# EAGLE design md_and_to_arduino_mega (EAGLE 9.5.2)
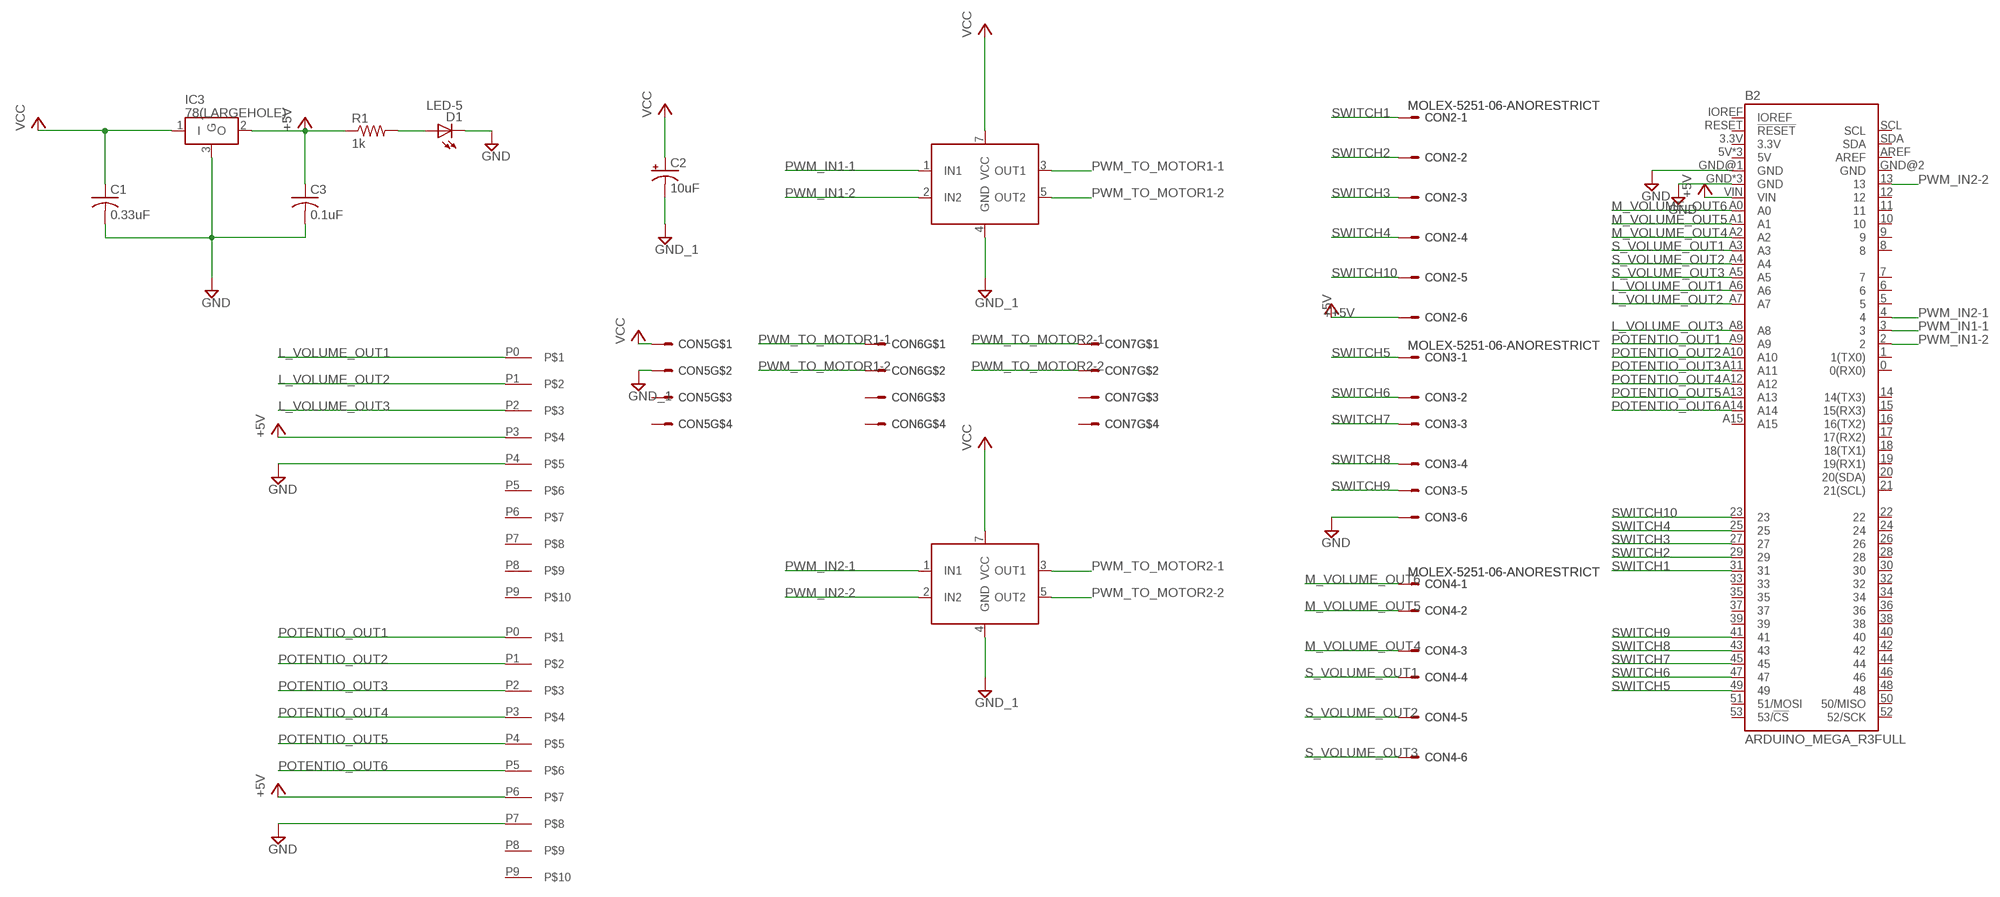
[diagram p0: schematic, sheet 1]

## Parts
B2  ARDUINO_MEGA_R3FULL  [ARDUINO_MEGA_NO_SILK]
C1  0.33uF  C-2012  [2012-C]
C2  10uF  CC-5-10.5  [E5-10,5]
C3  0.1uF  C-2012  [2012-C]
CON2  MOLEX-5251-06-ANORESTRICT  [5251-06-ANORESTRICT]
CON3  MOLEX-5251-06-ANORESTRICT  [5251-06-ANORESTRICT]
CON4  MOLEX-5251-06-ANORESTRICT  [5251-06-ANORESTRICT]
CON5  D-3200-2-VER2D3200S-2-TAB-VERTICAL-VER2  [D3200S-2-TAB-VERTICAL-VER2]
CON6  D-3200-2-VER2D3200S-2-TAB-VERTICAL-VER2  [D3200S-2-TAB-VERTICAL-VER2]
CON7  D-3200-2-VER2D3200S-2-TAB-VERTICAL-VER2  [D3200S-2-TAB-VERTICAL-VER2]
D1  LED-5  [LED5]
IC1  TA8428K  [TA8428K]
IC2  TA8428K  [TA8428K]
IC3  78(LARGEHOLE)  [7805-LARGEHOLE]
KYABE1  PINSOCKET_1X10  [PINSOCKET_1X10]
KYABE2  PINSOCKET_1X10  [PINSOCKET_1X10]
R1  1k  R-2012  [2012-R]

## Nets
+5V: B2.VIN C3.1 CON2.6 IC3.2(O) KYABE1.P6 KYABE2.P3 R1.1
GND: B2.GND B2.GND@1(GND) B2.GND@3(GND) B2.GND@4(GND) C1.2 C3.2 CON3.6 D1.K IC3.3(G) KYABE1.P7 KYABE2.P4
GND_1: C2.- CON5.2 IC1.4(GND) IC2.4(GND)
L_VOLUME_OUT1: B2.A6 KYABE2.P0
L_VOLUME_OUT2: B2.A7 KYABE2.P1
L_VOLUME_OUT3: B2.A8 KYABE2.P2
M_VOLUME_OUT4: B2.A2 CON4.3
M_VOLUME_OUT5: B2.A1 CON4.2
M_VOLUME_OUT6: B2.A0 CON4.1
N$1: D1.A R1.2
POTENTIO_OUT1: B2.A9 KYABE1.P0
POTENTIO_OUT2: B2.A10 KYABE1.P1
POTENTIO_OUT3: B2.A11 KYABE1.P2
POTENTIO_OUT4: B2.A12 KYABE1.P3
POTENTIO_OUT5: B2.A13 KYABE1.P4
POTENTIO_OUT6: B2.A14 KYABE1.P5
PWM_IN1-1: B2.3 IC1.1(IN1)
PWM_IN1-2: B2.2 IC1.2(IN2)
PWM_IN2-1: B2.4 IC2.1(IN1)
PWM_IN2-2: B2.13 IC2.2(IN2)
PWM_TO_MOTOR1-1: CON6.1 IC1.3(OUT1)
PWM_TO_MOTOR1-2: CON6.2 IC1.5(OUT2)
PWM_TO_MOTOR2-1: CON7.1 IC2.3(OUT1)
PWM_TO_MOTOR2-2: CON7.2 IC2.5(OUT2)
S_VOLUME_OUT1: B2.A3 CON4.4
S_VOLUME_OUT2: B2.A4 CON4.5
S_VOLUME_OUT3: B2.A5 CON4.6
SWITCH1: B2.31 CON2.1
SWITCH2: B2.29 CON2.2
SWITCH3: B2.27 CON2.3
SWITCH4: B2.25 CON2.4
SWITCH5: B2.49 CON3.1
SWITCH6: B2.47 CON3.2
SWITCH7: B2.45 CON3.3
SWITCH8: B2.43 CON3.4
SWITCH9: B2.41 CON3.5
SWITCH10: B2.23 CON2.5
VCC: C1.1 C2.+ CON5.1 IC1.7(VCC) IC2.7(VCC) IC3.1(I)
Unconnected: B2.0(0(RX0)) B2.1(1(TX0)) B2.3.3V B2.5 B2.5V B2.5V@1(5V) B2.5V@2(5V) B2.6 B2.7 B2.8 B2.9 B2.10 B2.11 B2.12 B2.14(14(TX3)) B2.15(15(RX3)) B2.16(16(TX2)) B2.17(17(RX2)) B2.18(18(TX1)) B2.19(19(RX1)) B2.20(20(SDA)) B2.21(21(SCL)) B2.22 B2.24 B2.26 B2.28 B2.30 B2.32 B2.33 B2.34 B2.35 B2.36 B2.37 B2.38 B2.39 B2.40 B2.42 B2.44 B2.46 B2.48 B2.50(50/MISO) B2.51(51/MOSI) B2.52(52/SCK) B2.53(53/!CS) B2.A15 B2.AREF B2.GND@2(GND) B2.IOREF B2.RESET(!RESET) B2.SCL B2.SDA CON5.P$1 CON5.P$2 CON6.P$1 CON6.P$2 CON7.P$1 CON7.P$2 KYABE1.P8 KYABE1.P9 KYABE2.P5 KYABE2.P6 KYABE2.P7 KYABE2.P8 KYABE2.P9

## Library data of the parts
B2 = SparkFun-Boards:ARDUINO_MEGA_R3: Arduino Mega R3 ATmega2560 R3 compatible footprint. SparkFun Products: Arduino Mega 2560 R3 <https://www.sparkfun.com/products/11061>
C1 C3 = Passive_Robotech:C
C2 = Passive_Robotech:CC
CON2-CON4 = Connector_Robotech:MOLEX-5251-06: CONNECTOR Molex 5251 6-pin wire to board 2.54 mm (.1 inch) pitch header
CON5-CON7 = Connector_Robotech:D-3200-2-VER2
D1 = Diode_Robotech:LED
IC1 IC2 = IC_Robotech:TA8428: Toshiba Motor Driver
IC3 = IC_Robotech:78*: Three Terminal Voltage Regulator
KYABE1 KYABE2 = mylib:PINSOCKET_1X10
R1 = Passive_Robotech:R

## Board
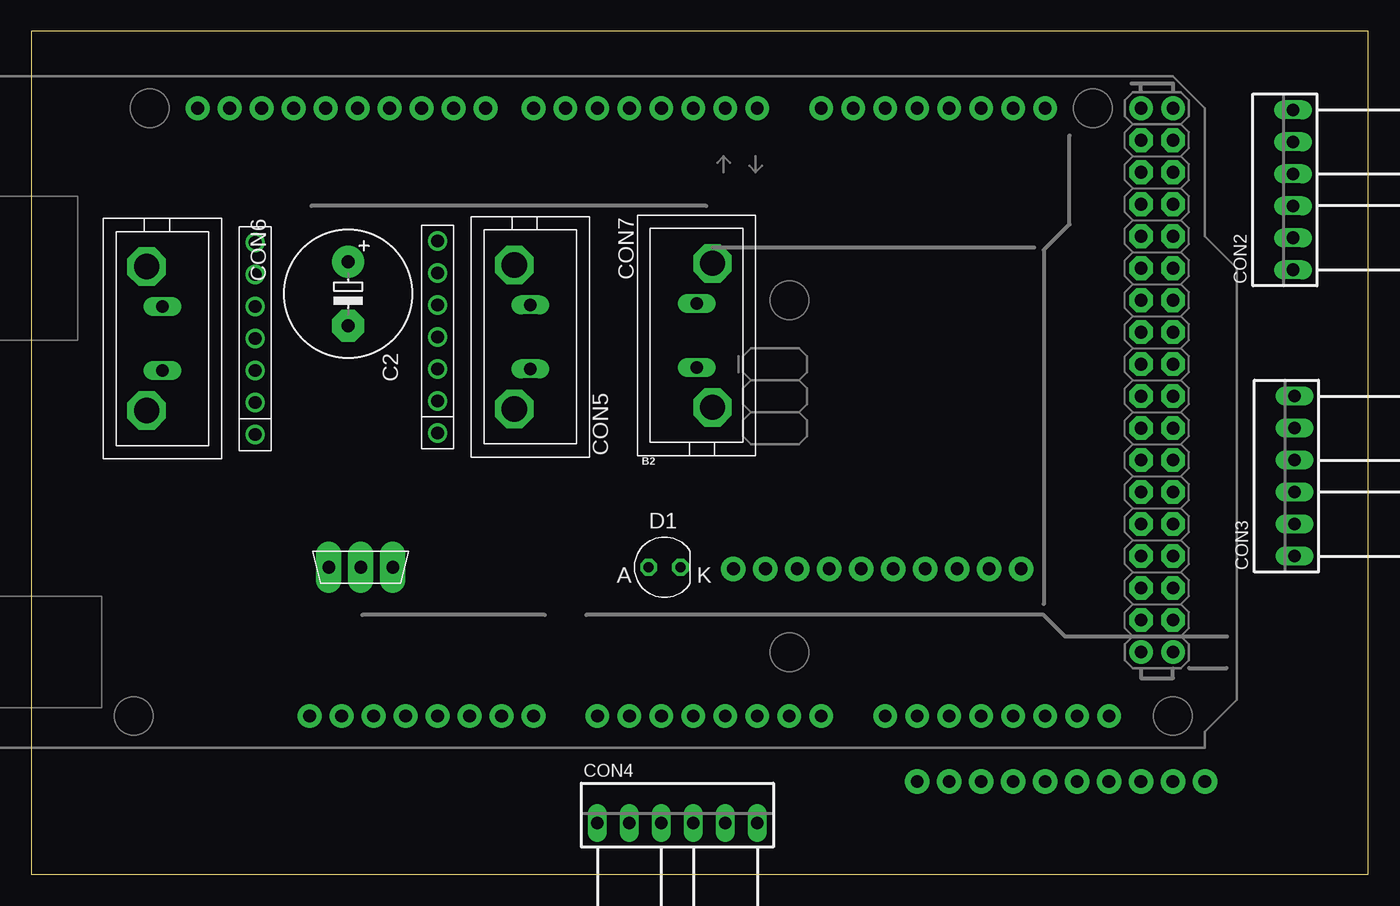
[diagram p1: board, top side]
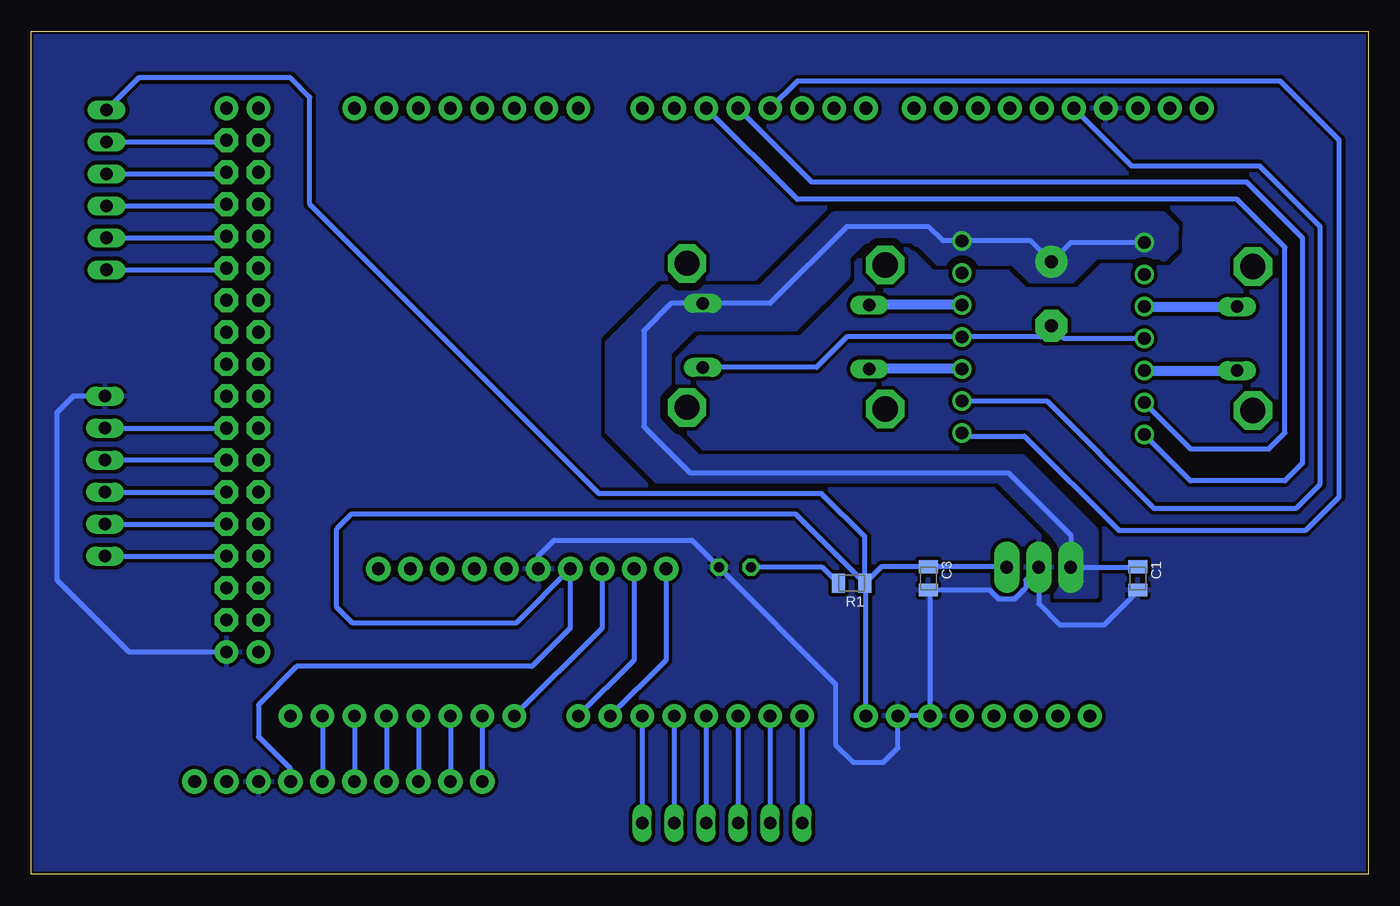
[diagram p2: board, bottom side, seen from below]

Size 106.17 x 66.93 mm. Coordinates in mm from the lower left corner, seen from the top.
Outline: 0,0 106.17,0 106.17,66.93 0,66.93 0,0
Copper layers (1*16): Top 0.0356mm / dielectric 1.5011mm / Bottom 0.0356mm
Design rules "formita": minimum track width 10mil, minimum drill 0.5994mm, track to track 0.3mm, track to pad 0.3mm, pad to pad 0.3mm, via to via 0.3mm, smd to smd 8mil, copper to edge 8mil, drill to drill 8mil, minimum pad ring 10mil, minimum via ring 8mil, stop-mask expansion 4mil, vias tented up to drill 1mm, thermal gap 10mil

### Footprints (pad centres in the part's own frame; a part is rotated, then mirrored left to right if it is on the bottom)
ARDUINO_MEGA_NO_SILK = drill 1.016 pad 1.88: 0 13.97,24.13; 1 11.43,24.13; 2 8.89,24.13; 3 6.35,24.13; 3.3V -13.97,-24.13; 4 3.81,24.13; 5 1.27,24.13; 5V -11.43,-24.13; 5V@1 44.45,24.13; 5V@2 46.99,24.13; 6 -1.27,24.13; 7 -3.81,24.13; 8 -7.62,24.13; 9 -10.16,24.13; 10 -12.7,24.13; 11 -15.24,24.13; 12 -17.78,24.13; 13 -20.32,24.13; 14 19.05,24.13; 15 21.59,24.13; 16 24.13,24.13; 17 26.67,24.13; 18 29.21,24.13; 19 31.75,24.13; 20 34.29,24.13; 21 36.83,24.13; A0 1.27,-24.13; A1 3.81,-24.13; A2 6.35,-24.13; A3 8.89,-24.13; A4 11.43,-24.13; A5 13.97,-24.13; A6 16.51,-24.13; A7 19.05,-24.13; A8 24.13,-24.13; A9 26.67,-24.13; A10 29.21,-24.13; A11 31.75,-24.13; A12 34.29,-24.13; A13 36.83,-24.13; A14 39.37,-24.13; A15 41.91,-24.13; AREF -25.4,24.13; GND -8.89,-24.13; GND@1 -6.35,-24.13; GND@2 44.45,-19.05; GND@3 46.99,-19.05; GND@4 -22.86,24.13; IOREF -19.05,-24.13; NC -21.59,-24.13; RESET -16.51,-24.13; SCL -30.48,24.13; SDA -27.94,24.13; VIN -3.81,-24.13 | drill 1.016 pad 1.88 octagon: 22 44.45,21.59; 23 46.99,21.59; 24 44.45,19.05; 25 46.99,19.05; 26 44.45,16.51; 27 46.99,16.51; 28 44.45,13.97; 29 46.99,13.97; 30 44.45,11.43; 31 46.99,11.43; 32 44.45,8.89; 33 46.99,8.89; 34 44.45,6.35; 35 46.99,6.35; 36 44.45,3.81; 37 46.99,3.81; 38 44.45,1.27; 39 46.99,1.27; 40 44.45,-1.27; 41 46.99,-1.27; 42 44.45,-3.81; 43 46.99,-3.81; 44 44.45,-6.35; 45 46.99,-6.35; 46 44.45,-8.89; 47 46.99,-8.89; 48 44.45,-11.43; 49 46.99,-11.43; 50 44.45,-13.97; 51 46.99,-13.97; 52 44.45,-16.51; 53 46.99,-16.51
2012-C = smd 1.016 x 1.524: 1 -0.921,0; 2 0.921,0
E5-10,5 = drill 1.016 pad 2.54: + -2.54,0 | drill 1.016 pad 2.54 octagon: - 2.54,0
5251-06-ANORESTRICT = drill 1 long: 1 6.35,0; 2 3.81,0; 3 1.27,0; 4 -1.27,0; 5 -3.81,0; 6 -6.35,0
D3200S-2-TAB-VERTICAL-VER2 = drill 1 long: 1 2.54,0; 2 -2.54,0 | drill 2 pad 3.048 octagon: P$1 5.715,-1.27; P$2 -5.715,-1.27
LED5 = drill 0.813 octagon: A -1.27,0; K 1.27,0
TA8428K = drill 1.016: 1 0,7.62; 2 0,5.08; 3 0,2.54; 4 0,0; 5 0,-2.54; 6 0,-5.08; 7 0,-7.62
7805-LARGEHOLE = drill 1.016 pad 2.032 long: 1 -2.54,0; 2 2.54,0; 3 0,0
PINSOCKET_1X10 = drill 1.021 pad 1.93: P0 -11.43,0; P1 -8.89,0; P2 -6.35,0; P3 -3.81,0; P4 -1.27,0; P5 1.27,0; P6 3.81,0; P7 6.35,0; P8 8.89,0; P9 11.43,0
2012-R = smd 1.016 x 1.524: 1 -1.048,0; 2 1.048,0

### Placement (x,y rotation side)
B2  43.69,36.7 0 top
C1  18.29,23.49 270 bottom
C2  25.15,46.1 270 top
C3  34.92,23.49 270 bottom
CON2  100.2,54.36 270 top
CON3  100.33,31.62 270 top
CON4  51.31,4.06 180 top
CON5  52.83,42.8 90 top
CON6  10.41,42.55 270 top
CON7  39.62,42.67 270 top
D1  50.29,24.38 0 top
IC1  17.78,42.55 180 top
IC2  32.26,42.67 180 top
IC3  26.16,24.38 0 top
KYABE1  81.79,7.37 0 top
KYABE2  67.18,24.26 0 top
R1  41.02,23.11 180 bottom

### Tracks (layer width: path | path; a pad name or v marks a point on that pad's centre or on a via)
+5V
  Bottom 0.406: IC3.2 28.73,24.42 C3.1 38.67,24.42 R1.1 | B2.VIN 39.88,23.02 R1.1 | R1.1 39.97,26.8 43.4,30.23 61.09,30.23 84.07,53.21 84.07,61.72 85.6,63.25 97.66,63.25 CON2.6 | KYABE1.P6 85.6,8.38 88.14,10.92 88.14,13.46 85.09,16.51 66.42,16.51 63.37,19.56 KYABE2.P3 67.69,19.94 80.65,19.94 81.92,21.21 81.92,27.43 80.77,28.58 45.43,28.58 R1.1
GND
  Bottom 0.406: C1.2 18.29,22.49 20.96,19.82 24.51,19.82 26.16,21.47 IC3.3 27.18,23.36 27.18,22.74 28.07,21.85 29.33,21.85 30.06,22.57 C3.2 34.8,22.45 B2.GND B2.GND@1 37.34,10.03 38.48,8.89 40.89,8.89 42.29,10.29 42.29,15.11 D1.K 53.72,26.54 64.64,26.54 65.91,25.27 KYABE2.P4 | CON3.6 102.87,37.97 104.14,36.7 104.14,23.37 98.43,17.65 B2.GND@3
  pour Bottom (rank 6): 0,66.93 0,0 1.02,0 106.17,0 106.17,66.55 106.17,66.93
GND_1
  Bottom 0.406: CON5.2 43.81,40.26 41.4,42.67 IC2.4 26.03,42.67 C2.- 24.13,42.55 IC1.4
L_VOLUME_OUT1
  Bottom 0.406: B2.A6 55.75,17.02 KYABE2.P0
L_VOLUME_OUT2
  Bottom 0.406: B2.A7 58.29,17.02 KYABE2.P1
L_VOLUME_OUT3
  Bottom 0.406: B2.A8 60.83,19.56 KYABE2.P2
M_VOLUME_OUT4
  Bottom 0.406: B2.A2 CON4.3
M_VOLUME_OUT5
  Bottom 0.406: B2.A1 CON4.2
M_VOLUME_OUT6
  Bottom 0.406: B2.A0 CON4.1
N$1
  Bottom 0.406: R1.2 43.34,24.38 D1.A
POTENTIO_OUT1
  Bottom 0.406: B2.A9 KYABE1.P0
POTENTIO_OUT2
  Bottom 0.406: B2.A10 KYABE1.P1
POTENTIO_OUT3
  Bottom 0.406: B2.A11 KYABE1.P2
POTENTIO_OUT4
  Bottom 0.406: B2.A12 KYABE1.P3
POTENTIO_OUT5
  Bottom 0.406: B2.A13 KYABE1.P4
POTENTIO_OUT6
  Bottom 0.406: B2.A14 KYABE1.P5
PWM_IN1-1
  Bottom 0.406: B2.3 44.2,54.99 9.65,54.99 5.21,50.55 5.21,32.64 6.6,31.24 14.1,31.24 IC1.1
PWM_IN1-2
  Bottom 0.406: IC1.2 14.1,33.78 7.87,33.78 6.6,35.05 6.6,49.78 10.41,53.59 45.34,53.59 B2.2
PWM_IN2-1
  Bottom 0.406: IC2.1 32,34.8 27.3,34.8 19.81,27.3 4.95,27.3 2.29,29.97 2.29,58.29 6.98,62.99 45.34,62.99 B2.4
PWM_IN2-2
  Bottom 0.406: IC2.2 25.53,37.59 17.02,29.08 5.71,29.08 3.81,30.99 3.81,51.44 8.64,56.26 18.8,56.26 B2.13
PWM_TO_MOTOR1-1
  Bottom 0.813: IC1.3 CON6.1
PWM_TO_MOTOR1-2
  Bottom 0.813: IC1.5 CON6.2
PWM_TO_MOTOR2-1
  Bottom 0.813: IC2.3 CON7.1
PWM_TO_MOTOR2-2
  Bottom 0.813: IC2.5 CON7.2
S_VOLUME_OUT1
  Bottom 0.406: B2.A3 CON4.4
S_VOLUME_OUT2
  Bottom 0.406: B2.A4 CON4.5
S_VOLUME_OUT3
  Bottom 0.406: B2.A5 CON4.6
SWITCH1
  Bottom 0.406: CON2.1 90.81,48.01 B2.31
SWITCH2
  Bottom 0.406: B2.29 90.81,50.55 CON2.2
SWITCH3
  Bottom 0.406: B2.27 90.81,53.09 CON2.3
SWITCH4
  Bottom 0.406: B2.25 90.81,55.63 CON2.4
SWITCH5
  Bottom 0.406: CON3.1 B2.49
SWITCH6
  Bottom 0.406: CON3.2 B2.47
SWITCH7
  Bottom 0.406: CON3.3 B2.45
SWITCH8
  Bottom 0.406: B2.43 CON3.4
SWITCH9
  Bottom 0.406: CON3.5 B2.41
SWITCH10
  Bottom 0.406: B2.23 90.81,58.17 CON2.5
VCC
  Bottom 0.406: C1.1 18.32,24.38 IC3.1 23.62,26.92 28.57,31.88 53.85,31.88 57.53,35.56 57.53,43.18 55.37,45.34 CON5.1 47.5,45.34 41.4,51.44 34.92,51.44 33.78,50.29 IC2.7 26.8,50.29 C2.+ 23.62,50.16 IC1.7
  pour Bottom (isolate 0.61, no thermals): 21.59,22.1 21.59,27.3 27.43,33.15 53.21,33.15 55.5,35.43 55.5,41.4 53.59,43.31 45.47,43.31 41.27,47.5 41.27,49.02 40,50.29 36.2,50.29 35.94,50.04 35.69,50.04 34.16,48.51 28.19,48.51 26.8,47.12 23.49,47.12 21.59,49.02 16.51,49.02 16.26,48.77 15.24,49.78 15.24,51.18 15.11,51.31 16.26,52.45 42.42,52.45 48.26,46.61 56.01,46.61 60.45,42.16 60.45,35.18 56.52,31.24 29.34,31.24 24.89,26.8 24.89,22.1